# Altium schematic sheet STM32_MCU.SchDoc
size A4; Organization: TESLA Motors, INC; Address1: 3500 Deer Creek Road; Address2: Palo Alto, CA; Address4: U.S.A.; SheetNumber: 5; SheetTotal: 8
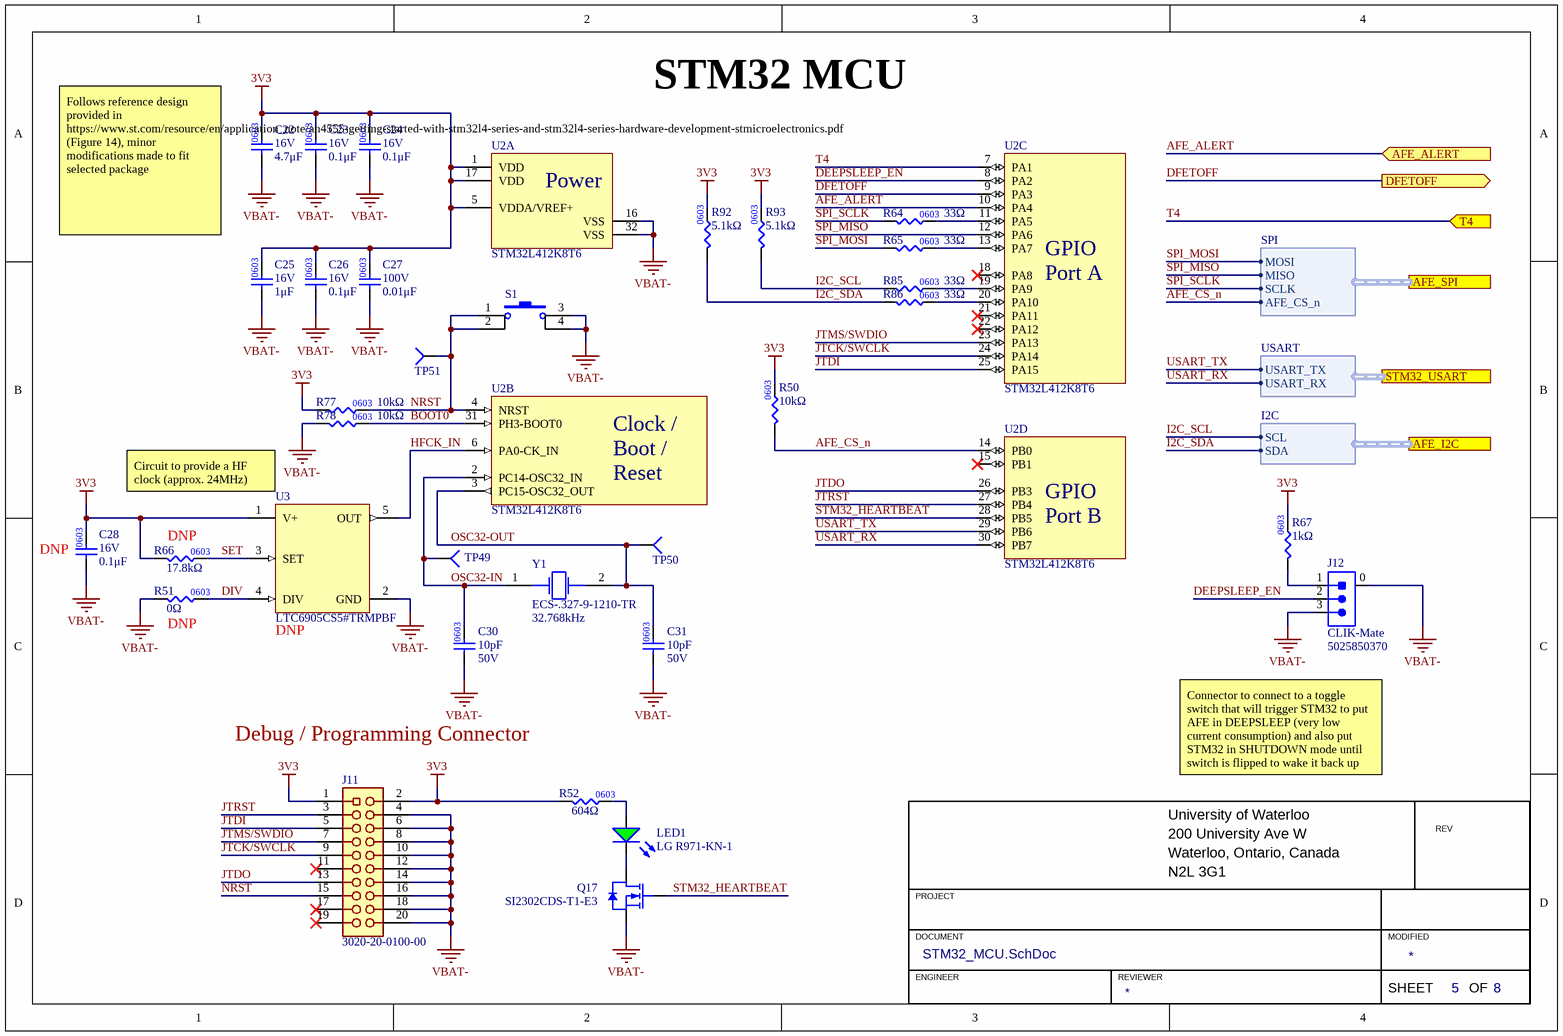
[diagram p0: STM32_MCU.SchDoc]

## Parts
C22  value 4.7μF  Voltage Rating: 16V  [CAP0603]  (hidden comment: CAP_4.7uF_16V_0603)
C23  value 0.1μF  Voltage Rating: 16V  [CAP0603]  (hidden comment: CAP_0.1uF_16V_0603)
C24  value 0.1μF  Voltage Rating: 16V  [CAP0603]  (hidden comment: CAP_0.1uF_16V_0603)
C25  value 1μF  Voltage Rating: 16V  [CAP0603]  (hidden comment: CAP_1uF_16V_0603)
C26  value 0.1μF  Voltage Rating: 16V  [CAP0603]  (hidden comment: CAP_0.1uF_16V_0603)
C27  value 0.01μF  Voltage Rating: 100V  [CAP0603]  (hidden comment: CAP_0.01uF_100V_0603)
C28  value 0.1μF  Voltage Rating: 16V  [CAP0603]  (hidden comment: CAP_0.1uF_16V_0603)
C30  value 10pF  Voltage Rating: 50V  [CAP0603]  (hidden comment: CAP_10pF_50V_0603)
C31  value 10pF  Voltage Rating: 50V  [CAP0603]  (hidden comment: CAP_10pF_50V_0603)
J11  3020-20-0100-00  [CNC_3020-20-0100-00]
J12  Family: CLIK-Mate  Manufacturer Part Number 1: 5025850370  [MOLEX-5025850370]  (hidden comment: CON_3M_SM_RA)
LED1  Manufacturer Part Number 1: LG R971-KN-1  [LED_0805_GREEN]  (hidden comment: LED_GREEN)
Q17  Manufacturer Part Number 1: SI2302CDS-T1-E3  [SOT23-3]  (hidden comment: NMOS_20V_6A)
R50  value 10kΩ  [RES0603]  (hidden comment: RES_10kΩ_0603_1%)
R51  value 0Ω  [RES0603]  (hidden comment: RES_0Ω_0603)
R52  value 604Ω  [RES0603]  (hidden comment: RES_604Ω_0603_1%)
R64  value 33Ω  [RES0603]  (hidden comment: RES_33Ω_0603_1%)
R65  value 33Ω  [RES0603]  (hidden comment: RES_33Ω_0603_1%)
R66  value 17.8kΩ  [RES0603]  (hidden comment: RES_17.8kΩ_0603_1%)
R67  value 1kΩ  [RES0603]  (hidden comment: RES_1kΩ_0603_1%)
R77  value 10kΩ  [RES0603]  (hidden comment: RES_10kΩ_0603_1%)
R78  value 10kΩ  [RES0603]  (hidden comment: RES_10kΩ_0603_1%)
R85  value 33Ω  [RES0603]  (hidden comment: RES_33Ω_0603_1%)
R86  value 33Ω  [RES0603]  (hidden comment: RES_33Ω_0603_1%)
R92  value 5.1kΩ  [RES0603]  (hidden comment: RES_5.1kΩ_0603_1%)
R93  value 5.1kΩ  [RES0603]  (hidden comment: RES_5.1kΩ_0603_1%)
S1  SW_SPST_NO_4.5x4.5  [SPST_PUSHBUTTON_TL3305AF260QG]  (value not drawn)
TP49  TESTPOINT_1MM_CIRCLE  [TESTPOINT_CIRCLE_1MM]  (value not drawn)  (no BOM)
TP50  TESTPOINT_1MM_CIRCLE  [TESTPOINT_CIRCLE_1MM]  (value not drawn)  (no BOM)
TP51  TESTPOINT_1MM_CIRCLE  [TESTPOINT_CIRCLE_1MM]  (value not drawn)  (no BOM)
U2  STM32L412K8T6  [STM-LQFP32]  (parts A,B,C,D of 4)
U3  LTC6905CS5#TRMPBF  [SOT23-5]
Y1  Frequency: 32.768kHz  Manufacturer Part Number 1: ECS-.327-9-1210-TR  [OSC_ECS-327TR-2]  (hidden comment: CRYSTAL_32.768KHZ)

## Ports
AFE_ALERT (in), AFE_I2C (harness I2C), AFE_SPI (harness SPI), DFETOFF (out), STM32_USART (harness USART), T4 (in)

## Harnesses
SPI: MOSI, MISO, SCLK, AFE_CS_n
USART: USART_TX, USART_RX
I2C: SCL, SDA

## Nets
3V3: C22.2 C23.2 C24.2 C25.2 C26.2 C27.2 C28.2 J11.1 J11.2 R50.2 R52.1 R66.1 R67.2 R77.1 R92.2 R93.2 U2.1(VDD) U2.5(VDDA/VREF+) U2.17(VDD) U3.1(V+)
VBAT-: C22.1 C23.1 C24.1 C25.1 C26.1 C27.1 C28.1 C30.1 C31.1 J11.4 J11.6 J11.8 J11.10 J11.12 J11.14 J11.16 J11.18 J11.20 J12.0 J12.3 Q17.2(SOURCE) R51.1 R78.1 S1.3 S1.4 U2.16(VSS) U2.32(VSS) U3.2(GND)
AFE_ALERT: U2.10(PA4) ; port AFE_ALERT
AFE_CS_n: R50.1 U2.14(PB0) ; port AFE_SPI.AFE_CS_n
BOOT0: R78.2 U2.31(PH3-BOOT0)
DEEPSLEEP_EN: J12.2 U2.8(PA2)
DFETOFF: U2.9(PA3) ; port DFETOFF
DIV: R51.2 U3.4(DIV)
HFCK_IN: U2.6(PA0-CK_IN) U3.5(OUT)
I2C_SCL: R85.1 R93.1 ; port AFE_I2C.SCL
I2C_SDA: R86.1 R92.1 ; port AFE_I2C.SDA
JTCK/SWCLK: J11.9 U2.24(PA14)
JTDI: J11.5 U2.25(PA15)
JTDO: J11.13 U2.26(PB3)
JTMS/SWDIO: J11.7 U2.23(PA13)
JTRST: J11.3 U2.27(PB4)
NRST: J11.15 R77.2 S1.1 S1.2 TP51.1(=value) U2.4(NRST)
OSC32-IN: C30.2 TP49.1(=value) U2.2(PC14-OSC32_IN) Y1.1
OSC32-OUT: C31.2 TP50.1(=value) U2.3(PC15-OSC32_OUT) Y1.2
SET: R66.2 U3.3(SET)
SPI_MISO: U2.12(PA6) ; port AFE_SPI.MISO
SPI_MOSI: R65.1 ; port AFE_SPI.MOSI
SPI_SCLK: R64.1 ; port AFE_SPI.SCLK
STM32_HEARTBEAT: Q17.1(GATE) U2.28(PB5)
T4: U2.7(PA1) ; port T4
USART_RX: U2.30(PB7) ; port STM32_USART.USART_RX
USART_TX: U2.29(PB6) ; port STM32_USART.USART_TX
NetJ12_1: J12.1 R67.1
NetLED1_1: LED1.1(A) R52.2
NetLED1_2: LED1.2(K) Q17.3(DRAIN)
NetR64_2: R64.2 U2.11(PA5)
NetR65_2: R65.2 U2.13(PA7)
NetR85_2: R85.2 U2.19(PA9)
NetR86_2: R86.2 U2.20(PA10)

Not connected (* = marked no-connect by the designer): J11 11* 17* 19*; U2 15(PB1)* 18(PA8)* 21(PA11)* 22(PA12)*

## Notes on the sheet
- STM32 MCU
- Follows reference design provided in https://www.st.com/resource/en/application_note/an4555-getting-started-with-stm32l4-series-and-stm32l4-series-hardware-development-stmicroelectronics.pdf (Figure 14), minor modifications made to fit selected package
- (near U3) Circuit to provide a HF clock (approx. 24MHz)
- (near C28) DNP
- (near R66) DNP
- (near R51) DNP
- (near U3) DNP
- Debug / Programming Connector
- Connector to connect to a toggle switch that will trigger STM32 to put AFE in DEEPSLEEP (very low current consumption) and also put STM32 in SHUTDOWN mode until switch is flipped to wake it back up
- University of Waterloo
- 200 University Ave W
- REV
- PROJECT
- Waterloo, Ontario, Canada
- N2L 3G1
- DOCUMENT
- ENGINEER
- REVIEWER
- MODIFIED
- SHEET
- OF
- (in symbol CAP_0.01uF_100V_0603) 0603
- (in symbol RES_17.8kΩ_0603_1%) 0603
- (in symbol RES_604Ω_0603_1%) 0603
- (in symbol STM32L412K8T6, part A) Power
- (in symbol STM32L412K8T6, part B) Clock / / Boot / / Reset
- (in symbol STM32L412K8T6, part C) GPIO / Port A
- (in symbol STM32L412K8T6, part D) GPIO / Port B

## Library data of the parts
C22 = CAP_4.7uF_16V_0603: CAP CER 4.7UF 16V X6S 0603; Manufacturer Part Number 1: GRM188C81C475KE11D; Manufacturer 1: Murata Electronics; Supplier Part Number 1: 490-13362-1-ND; Supplier 1: Digi-Key; Mounting Type: SMD; Package: 0603; Dielectric: X6S
C23 C24 C26 C28 = CAP_0.1uF_16V_0603: CAP CER 0.1UF 16V X7R 0603; Manufacturer Part Number 1: CC0603KRX7R7BB104; Manufacturer 1: Yageo; Package: 0603; Supplier Part Number 1: 311-1088-1-ND; Supplier 1: Digi-Key; Dielectric: X7R
C25 = CAP_1uF_16V_0603: CAP CER 1UF 16V X7R 0603; Manufacturer 1: Yageo; Manufacturer Part Number 1: CC0603KPX7R7BB105; Supplier Part Number 1: 13-CC0603KPX7R7BB105CT-ND; Supplier 1: Digi-Key; Mounting Type: SMD; Package: 0603; Dielectric: X7R
C27 = CAP_0.01uF_100V_0603: CAP CER 0.01uF 100V X7R 0603; Manufacturer Part Number 1: GCM188R72A103KA37J; Manufacturer 1: Murata Electronics; Supplier Part Number 1: 490-8028-1-ND; Supplier 1: Digi-Key; Dielectric: X7R
C30 C31 = CAP_10pF_50V_0603: CAP CER 10PF 50V X7R 0603; Manufacturer 1: KEMET; Manufacturer Part Number 1: C0603C100J5RAC7867; Package: 0603; Supplier 1: Digi-Key; Supplier Part Number 1: 399-C0603C100J5RAC7867CT-ND
J11 = CON_10x2_HEADER: CONN HEADER VERT 20POS 2.54MM; Manufacturer 1: CNC Tech; Manufacturer Part Number 1: 3020-20-0100-00; Supplier 1: Digi-Key; Supplier Part Number 1: 1175-1612-ND
J12 = CON_3M_SM_RA: CONN RCPT 3POS 0.059 TIN SMD R/A; Manufacturer 1: Molex; Current Rating: 2A; Voltage Rating: 100V; Pitch: 1.5mm; Supplier 1: Digi-Key; Mounting Type: SMD; Package/Footprint: SMD; Orientation: Right Angle; Supplier Part Number 1: WM12831CT-ND
LED1 = LED_GREEN: LED GREEN DIFFUSED 0805 SMD; Manufacturer 1: OSRAM; Forward Voltage Drop: 2.2V; Package/Footprint: 0805; Supplier Part Number 1: 475-1410-1-ND; Supplier 1: Digi-Key; Mounting Type: SMD
Q17 = NMOS_20V_2.6A: MOSFET N-CH 20V 2.6A SOT23-3; Manufacturer 1: Vishay Siliconix; Package/Footprint: SOT-23-3; Supplier 1: Digi-Key; Supplier Part Number 1: SI2302CDS-T1-E3CT-ND
R50 R77 R78 = RES_10kΩ_0603_1%: RES 10K OHM 1% 1/8W 0603; Manufacturer 1: Stackpole Electronics Inc; Manufacturer Part Number 1: RNCP0603FTD10K0; Supplier Part Number 1: RNCP0603FTD10K0CT-ND; Supplier 1: Digi-Key; Mounting Type: SMD; Package: 0603
R51 = RES_0Ω_0603: RES 0 OHM JUMPER 1/10W 0603; Manufacturer 1: Yageo; Manufacturer Part Number 1: RC0603JR-070RL; Supplier Part Number 1: 311-0.0GRCT-ND; Supplier 1: Digi-Key; Mounting Type: SMD; Package: 0603
R52 = RES_604Ω_0603_1%: RES 604 OHM 1% 1/10W 0603; Manufacturer 1: Yageo; Manufacturer Part Number 1: RC0603FR-07604RL; Supplier Part Number 1: 311-604HRCT-ND; Supplier 1: Digi-Key
R64 R65 R85 R86 = RES_33Ω_0603_1%: RES 33 OHM 1% 1/10W 0603; Manufacturer 1: Vishay; Manufacturer Part Number 1: CRCW060333R0FKEA; Supplier 1: Digi-Key; Mounting Type: SMD; Supplier Part Number 1: 541-33.0HCT-ND; Package: 0603
R66 = RES_17.8kΩ_0603_1%: RES 17.8K OHM 1% 1/10W 0603; Manufacturer 1: YAGEO; Manufacturer Part Number 1: RC0603FR-0717K8L; Supplier 1: Digi-Key; Supplier Part Number 1: 311-17.8KHRCT-ND
R67 = RES_1kΩ_0603_1%: RES 1K OHM 1% 1/8W 0603; Manufacturer 1: Stackpole Electronics Inc; Manufacturer Part Number 1: RNCP0603FTD1K00; Supplier Part Number 1: RNCP0603FTD1K00CT-ND; Supplier 1: Digi-Key; Mounting Type: SMD; Package: 0603
R92 R93 = RES_5.1kΩ_0603_1%: RES 5.1K OHM 1% 1/10W 0603; Manufacturer 1: YAGEO; Manufacturer Part Number 1: RC0603FR-135K1L; Mounting Type: SMD; Package: 0603; Supplier 1: Digi-Key; Supplier Part Number 1: 13-RC0603FR-135K1LCT-ND
S1 = SW_SPST_NO_4.5x4.5: SWITCH TACTILE SPST-NO 50MA 12V; Manufacturer Part Number 1: TL3305AF260QG; Manufacturer 1: E-Switch; Mounting Type: SMD; Supplier 1: Digi-Key; Supplier Part Number 1: EG5353CT-ND
TP49-TP51 = TESTPOINT_1MM_CIRCLE: TESTPOINT 1MM CIRCLE
U2 = STM32L412K8T6: IC MCU 32BIT 64KB FLASH 32LQFP; Manufacturer 1: STMicroelectronics; Package/Footprint: 32-LQFP; Manufacturer Part Number 1: STM32L412K8T6; Supplier 1: Digi-Key; Supplier Part Number 1: 497-STM32L412K8T6-ND
U3 = IC_OSC_LTC6905: IC OSC SILICON PROG TSOT23-5; Manufacturer 1: Analog Devices Inc.; Package/Footprint: SOT-23-5; Manufacturer Part Number 1: LTC6905CS5#TRMPBF; Supplier 1: Digi-Key; Supplier Part Number 1: 505-LTC6905CS5#TRMPBFCT-ND
Y1 = CRYSTAL_32.768KHZ: CRYSTAL 32.7680KHZ 9PF SMD; Manufacturer 1: ECS Inc.; Supplier 1: Digi-Key; Supplier Part Number 1: XC2283CT-ND